# Altium project S11830_1.PrjPCB
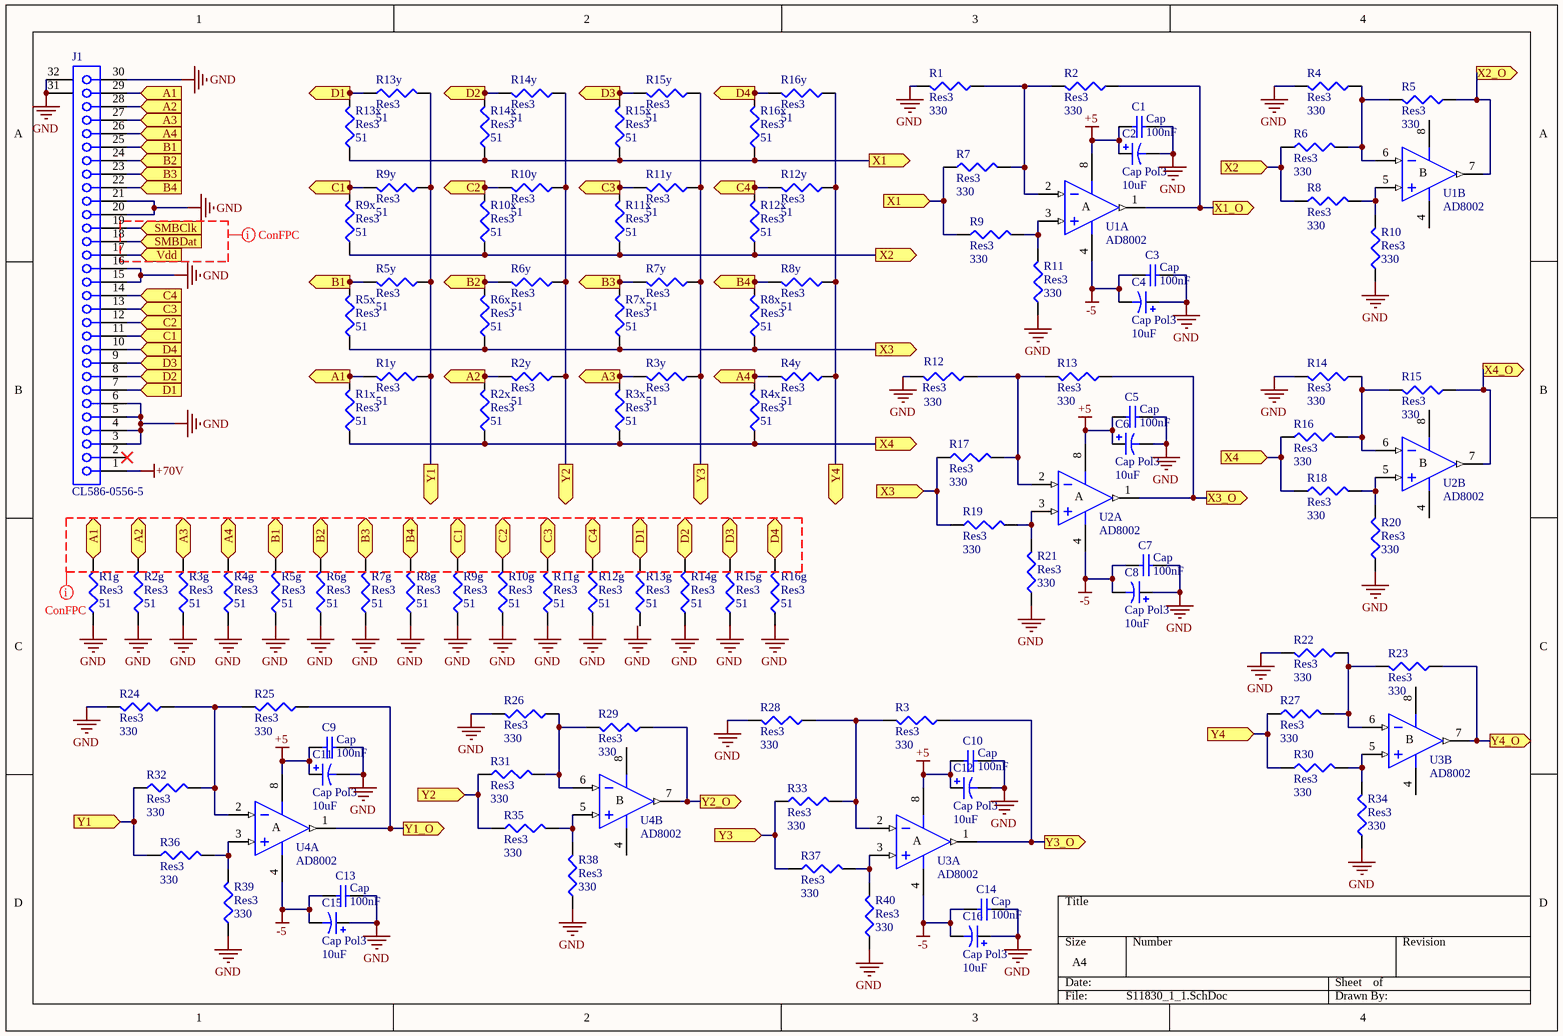
[diagram p0: S11830_1_1.SchDoc]
2 sheets, 204 parts. Net scope: flat (ports and power ports of the same name join across sheets).
Board file: S11830_1.PcbDoc
Sheets:
  S11830_1_1.SchDoc
  S11830_1_2.SchDoc

## Sheet S11830_1_1.SchDoc
size A4

### Parts
C1  Cap  value 100nF  [6-0805_N]
C2  Cap Pol3  value 10uF  [6-0805_N]
C3  Cap  value 100nF  [6-0805_N]
C4  Cap Pol3  value 10uF  [6-0805_N]
C5  Cap  value 100nF  [6-0805_N]
C6  Cap Pol3  value 10uF  [6-0805_N]
C7  Cap  value 100nF  [6-0805_N]
C8  Cap Pol3  value 10uF  [6-0805_N]
C9  Cap  value 100nF  [6-0805_N]
C10  Cap  value 100nF  [6-0805_N]
C11  Cap Pol3  value 10uF  [6-0805_N]
C12  Cap Pol3  value 10uF  [6-0805_N]
C13  Cap  value 100nF  [6-0805_N]
C14  Cap  value 100nF  [6-0805_N]
C15  Cap Pol3  value 10uF  [6-0805_N]
C16  Cap Pol3  value 10uF  [6-0805_N]
J1  CL586-0556-5  [FH12A-30S-0.5SH]
R1  Res3  value 330  [J1-0603]
R1g  Res3  value 51  [0402]
R1x  Res3  value 51  [0402]
R1y  Res3  value 51  [0402]
R2  Res3  value 330  [J1-0603]
R2g  Res3  value 51  [0402]
R2x  Res3  value 51  [0402]
R2y  Res3  value 51  [0402]
R3  Res3  value 330  [J1-0603]
R3g  Res3  value 51  [0402]
R3x  Res3  value 51  [0402]
R3y  Res3  value 51  [0402]
R4  Res3  value 330  [J1-0603]
R4g  Res3  value 51  [0402]
R4x  Res3  value 51  [0402]
R4y  Res3  value 51  [0402]
R5  Res3  value 330  [J1-0603]
R5g  Res3  value 51  [0402]
R5x  Res3  value 51  [0402]
R5y  Res3  value 51  [0402]
R6  Res3  value 330  [J1-0603]
R6g  Res3  value 51  [0402]
R6x  Res3  value 51  [0402]
R6y  Res3  value 51  [0402]
R7  Res3  value 330  [J1-0603]
R7g  Res3  value 51  [0402]
R7x  Res3  value 51  [0402]
R7y  Res3  value 51  [0402]
R8  Res3  value 330  [J1-0603]
R8g  Res3  value 51  [0402]
R8x  Res3  value 51  [0402]
R8y  Res3  value 51  [0402]
R9  Res3  value 330  [J1-0603]
R9g  Res3  value 51  [0402]
R9x  Res3  value 51  [0402]
R9y  Res3  value 51  [0402]
R10  Res3  value 330  [J1-0603]
R10g  Res3  value 51  [0402]
R10x  Res3  value 51  [0402]
R10y  Res3  value 51  [0402]
R11  Res3  value 330  [J1-0603]
R11g  Res3  value 51  [0402]
R11x  Res3  value 51  [0402]
R11y  Res3  value 51  [0402]
R12  Res3  value 330  [J1-0603]
R12g  Res3  value 51  [0402]
R12x  Res3  value 51  [0402]
R12y  Res3  value 51  [0402]
R13  Res3  value 330  [J1-0603]
R13g  Res3  value 51  [0402]
R13x  Res3  value 51  [0402]
R13y  Res3  value 51  [0402]
R14  Res3  value 330  [J1-0603]
R14g  Res3  value 51  [0402]
R14x  Res3  value 51  [0402]
R14y  Res3  value 51  [0402]
R15  Res3  value 330  [J1-0603]
R15g  Res3  value 51  [0402]
R15x  Res3  value 51  [0402]
R15y  Res3  value 51  [0402]
R16  Res3  value 330  [J1-0603]
R16g  Res3  value 51  [0402]
R16x  Res3  value 51  [0402]
R16y  Res3  value 51  [0402]
R17  Res3  value 330  [J1-0603]
R18  Res3  value 330  [J1-0603]
R19  Res3  value 330  [J1-0603]
R20  Res3  value 330  [J1-0603]
R21  Res3  value 330  [J1-0603]
R22  Res3  value 330  [J1-0603]
R23  Res3  value 330  [J1-0603]
R24  Res3  value 330  [J1-0603]
R25  Res3  value 330  [J1-0603]
R26  Res3  value 330  [J1-0603]
R27  Res3  value 330  [J1-0603]
R28  Res3  value 330  [J1-0603]
R29  Res3  value 330  [J1-0603]
R30  Res3  value 330  [J1-0603]
R31  Res3  value 330  [J1-0603]
R32  Res3  value 330  [J1-0603]
R33  Res3  value 330  [J1-0603]
R34  Res3  value 330  [J1-0603]
R35  Res3  value 330  [J1-0603]
R36  Res3  value 330  [J1-0603]
R37  Res3  value 330  [J1-0603]
R38  Res3  value 330  [J1-0603]
R39  Res3  value 330  [J1-0603]
R40  Res3  value 330  [J1-0603]
U1  AD8002  [SO-8_M]  (parts A,B of 2)
U2  AD8002  [SO-8_M]  (parts A,B of 2)
U3  AD8002  [SO-8_M]  (parts A,B of 2)
U4  AD8002  [SO-8_M]  (parts A,B of 2)

### Ports
A1 (in), A1 (out), A2 (in), A2 (out), A3 (in), A3 (out), A4 (in), A4 (out), B1 (in), B1 (out), B2 (in), B2 (out), B3 (in), B3 (out), B4 (in), B4 (out), C1 (in), C1 (out), C2 (in), C2 (out), C3 (in), C3 (out), C4 (in), C4 (out), D1 (in), D1 (out), D2 (in), D2 (out), D3 (in), D3 (out), D4 (in), D4 (out), SMBClk (in), SMBDat (in), Vdd (in), X1 (in), X1 (out), X1_O (out), X2 (in), X2 (out), X2_O (out), X3 (in), X3 (out), X3_O (out), X4 (in), X4 (out), X4_O (out), Y1 (in), Y1 (out), Y1_O (out), Y2 (in), Y2 (out), Y2_O (out), Y3 (in), Y3 (out), Y3_O (out), Y4 (in), Y4 (out), Y4_O (out)

### Nets
+5: C1.2 C2.1 C5.2 C6.1 C9.2 C10.2 C11.1 C12.1 U1.8(V+) U2.8(V+) U3.8(V+) U4.8(V+)
+70V: J1.1
-5: C3.2 C4.2 C7.2 C8.2 C13.2 C14.2 C15.2 C16.2 U1.4(V-) U2.4(V-) U3.4(V-) U4.4(V-)
GND: C1.1 C2.2 C3.1 C4.1 C5.1 C6.2 C7.1 C8.1 C9.1 C10.1 C11.2 C12.2 C13.1 C14.1 C15.1 C16.1 J1.3 J1.4 J1.5 J1.6 J1.15 J1.16 J1.20 J1.21 J1.30 J1.31(MH1) J1.32(MH2) R1.2 R1g.1 R2g.1 R3g.1 R4.2 R4g.1 R5g.1 R6g.1 R7g.1 R8g.1 R9g.1 R10.1 R10g.1 R11.1 R11g.1 R12.2 R12g.1 R14.2 R14g.1 R15g.1 R16g.1 R20.1 R21.1 R22.2 R24.2 R26.2 R28.2 R34.1 R38.1 R39.1 R40.1
NetC1x_1: R2.1 U1.1(OUT) ; port X1_O
NetC1y_1: R25.1 U4.1(OUT) ; port Y1_O
NetC2x_1: R5.1 U1.7(OUT) ; port X2_O
NetC2y_1: R29.1 U4.7(OUT) ; port Y2_O
NetC3x_1: R13.1 U2.1(OUT) ; port X3_O
NetC3y_1: R3.1 U3.1(OUT) ; port Y3_O
NetC4x_1: R15.1 U2.7(OUT) ; port X4_O
NetC4y_1: R23.1 U3.7(OUT) ; port Y4_O
NetJ1_7: J1.7 R13g.2 R13x.2 R13y.1 ; port D1
NetJ1_8: J1.8 R14g.2 R14x.2 R14y.2 ; port D2
NetJ1_9: J1.9 R15g.2 R15x.2 R15y.2 ; port D3
NetJ1_10: J1.10 R16g.2 R16x.2 R16y.2 ; port D4
NetJ1_11: J1.11 R9g.2 R9x.2 R9y.2 ; port C1
NetJ1_12: J1.12 R10g.2 R10x.2 R10y.2 ; port C2
NetJ1_13: J1.13 R11g.2 R11x.2 R11y.2 ; port C3
NetJ1_14: J1.14 R12g.2 R12x.2 R12y.2 ; port C4
NetJ1_17: J1.17 ; port Vdd
NetJ1_18: J1.18 ; port SMBDat
NetJ1_19: J1.19 ; port SMBClk
NetJ1_22: J1.22 R8g.2 R8x.2 R8y.2 ; port B4
NetJ1_23: J1.23 R7g.2 R7x.2 R7y.2 ; port B3
NetJ1_24: J1.24 R6g.2 R6x.2 R6y.2 ; port B2
NetJ1_25: J1.25 R5g.2 R5x.2 R5y.2 ; port B1
NetJ1_26: J1.26 R4g.2 R4x.2 R4y.2 ; port A4
NetJ1_27: J1.27 R3g.2 R3x.2 R3y.2 ; port A3
NetJ1_28: J1.28 R2g.2 R2x.2 R2y.2 ; port A2
NetJ1_29: J1.29 R1g.2 R1x.2 R1y.2 ; port A1
NetR1_1: R1.1 R2.2 R7.2 U1.2(IN-)
NetR1x_1: R1x.1 R2x.1 R3x.1 R4x.1 R16.1 R18.1 ; port X4
NetR1y_1: R1y.1 R5y.1 R9y.1 R13y.2 R32.1 R36.1 ; port Y1
NetR2y_1: R2y.1 R6y.1 R10y.1 R14y.1 R31.1 R35.1 ; port Y2
NetR3_2: R3.2 R28.1 R33.2 U3.2(IN-)
NetR3y_1: R3y.1 R7y.1 R11y.1 R15y.1 R33.1 R37.1 ; port Y3
NetR4_1: R4.1 R5.2 R6.2 U1.6(IN-)
NetR4y_1: R4y.1 R8y.1 R12y.1 R16y.1 R27.1 R30.1 ; port Y4
NetR5x_1: R5x.1 R6x.1 R7x.1 R8x.1 R17.1 R19.1 ; port X3
NetR6_1: R6.1 R8.1 R9x.1 R10x.1 R11x.1 R12x.1 ; port X2
NetR7_1: R7.1 R9.1 R13x.1 R14x.1 R15x.1 R16x.1 ; port X1
NetR8_2: R8.2 R10.2 U1.5(IN+)
NetR9_2: R9.2 R11.2 U1.3(IN+)
NetR12_1: R12.1 R13.2 R17.2 U2.2(IN-)
NetR14_1: R14.1 R15.2 R16.2 U2.6(IN-)
NetR18_2: R18.2 R20.2 U2.5(IN+)
NetR19_2: R19.2 R21.2 U2.3(IN+)
NetR22_1: R22.1 R23.2 R27.2 U3.6(IN-)
NetR24_1: R24.1 R25.2 R32.2 U4.2(IN-)
NetR26_1: R26.1 R29.2 R31.2 U4.6(IN-)
NetR30_2: R30.2 R34.2 U3.5(IN+)
NetR35_2: R35.2 R38.2 U4.5(IN+)
NetR36_2: R36.2 R39.2 U4.3(IN+)
NetR37_2: R37.2 R40.2 U3.3(IN+)

Not connected (* = marked no-connect by the designer): J1 2*; R13g 1

### Layout directives
net class Undefined: (no net found under the mark)

### Notes on the sheet
- Labels drawn without touching a wire or pin: GND
- (in symbol AD8002AR, part A) A
- (in symbol AD8002AR, part B) B

### Library data of the parts
C1 C3 C5 C7 C9 C10 C13 C14 = Cap: Capacitor; Published: 8-Jun-2000; LatestRevisionDate: 17-Jul-2002; LatestRevisionNote: Re-released for DXP Platform.; PackageReference: RAD-0.3; Publisher: Altium Limited; PackageDescription: Radial Cap, Thru-Hole; 2 Leads; 0.3 in Pin Spacing
C2 C4 C6 C8 C11 C12 C15 C16 = Cap Pol3: Polarized Capacitor (Surface Mount); Published: 8-Jun-2000; LatestRevisionDate: 29-May-2009; LatestRevisionNote: IPC-7351 Footprint Added.; PackageReference: C0805; Publisher: Altium Limited; PackageDescription: Chip Capacitor
J1 = CL586-0556-5: FH12 Series, "Flip-Lock" SMT/ZIF FFC/FPC Connector - 0.5mm Spaced Top Contact; Positions: 30; ContactMaterial: Phosphor Bronze; Current: 0.4A; PCB_Layout: Complies with manufacturer's recommendation.; Note: Pad dimensions follow nominal values, Suitable for Wave Soldering, Adjust for Re-flow.; Published: 17-Jul-2002; DatasheetVersion: 13-Nov-2000; PackageVersion: 13-Nov-2000; PackageReference: FH12A-30S-0.5SH; Publisher: Altium Limited; ComponentLink1Description: Manufacturer Link; ComponentLink1URL: http://www.hiroseusa.com/; ComponentLink2Description: Datasheet; ComponentLink2URL: http://www.hirose.co.jp/cataloge_hp/e58605370.pdf
R1 R1g R1x R1y R2 R2g R2x R2y R3 R3g R3x R3y R4 R4g R4x R4y R5 R5g R5x R5y R6 R6g R6x R6y R7 R7g R7x R7y R8 R8g R8x R8y R9 R9g R9x R9y R10 R10g R10x R10y R11 R11g R11x R11y R12 R12g R12x R12y R13 R13g R13x R13y R14 R14g R14x R14y R15 R15g R15x R15y R16 R16g R16x R16y R17-R40 = Res3: Resistor; Published: 8-Jun-2000; LatestRevisionDate: 29-May-2009; LatestRevisionNote: IPC-7351 Footprint Added.; PackageReference: J1-0603; Publisher: Altium Limited; PackageDescription: Chip Resistor
U1-U4 = AD8002AR: Dual 600MHz, 50mW Current Feedback Amplifier; Published: 8-Jun-2000; LatestRevisionDate: 13-Apr-2006; LatestRevisionNote: IPC-7351 Footprint Added.; DatasheetVersion: REV. C 1999; PackageVersion: revA; PackageReference: SO-8; Publisher: Altium Limited; PackageDescription: 8-Pin Small Outline Integrated Circuit 1.27 mm Pitch; Code_JEDEC: MS-012-AA; Code_IPC: SOIC127P600-8; ComponentLink1Description: Manufacturer Link; ComponentLink1URL: http://www.analog.com/en/prod/0,,759_786_AD8002%2C00.html; ComponentLink2Description: Datasheet; ComponentLink2URL: http://www.analog.com/UploadedFiles/Data_Sheets/147523773AD8002_d.pdf

## Sheet S11830_1_2.SchDoc
size A4
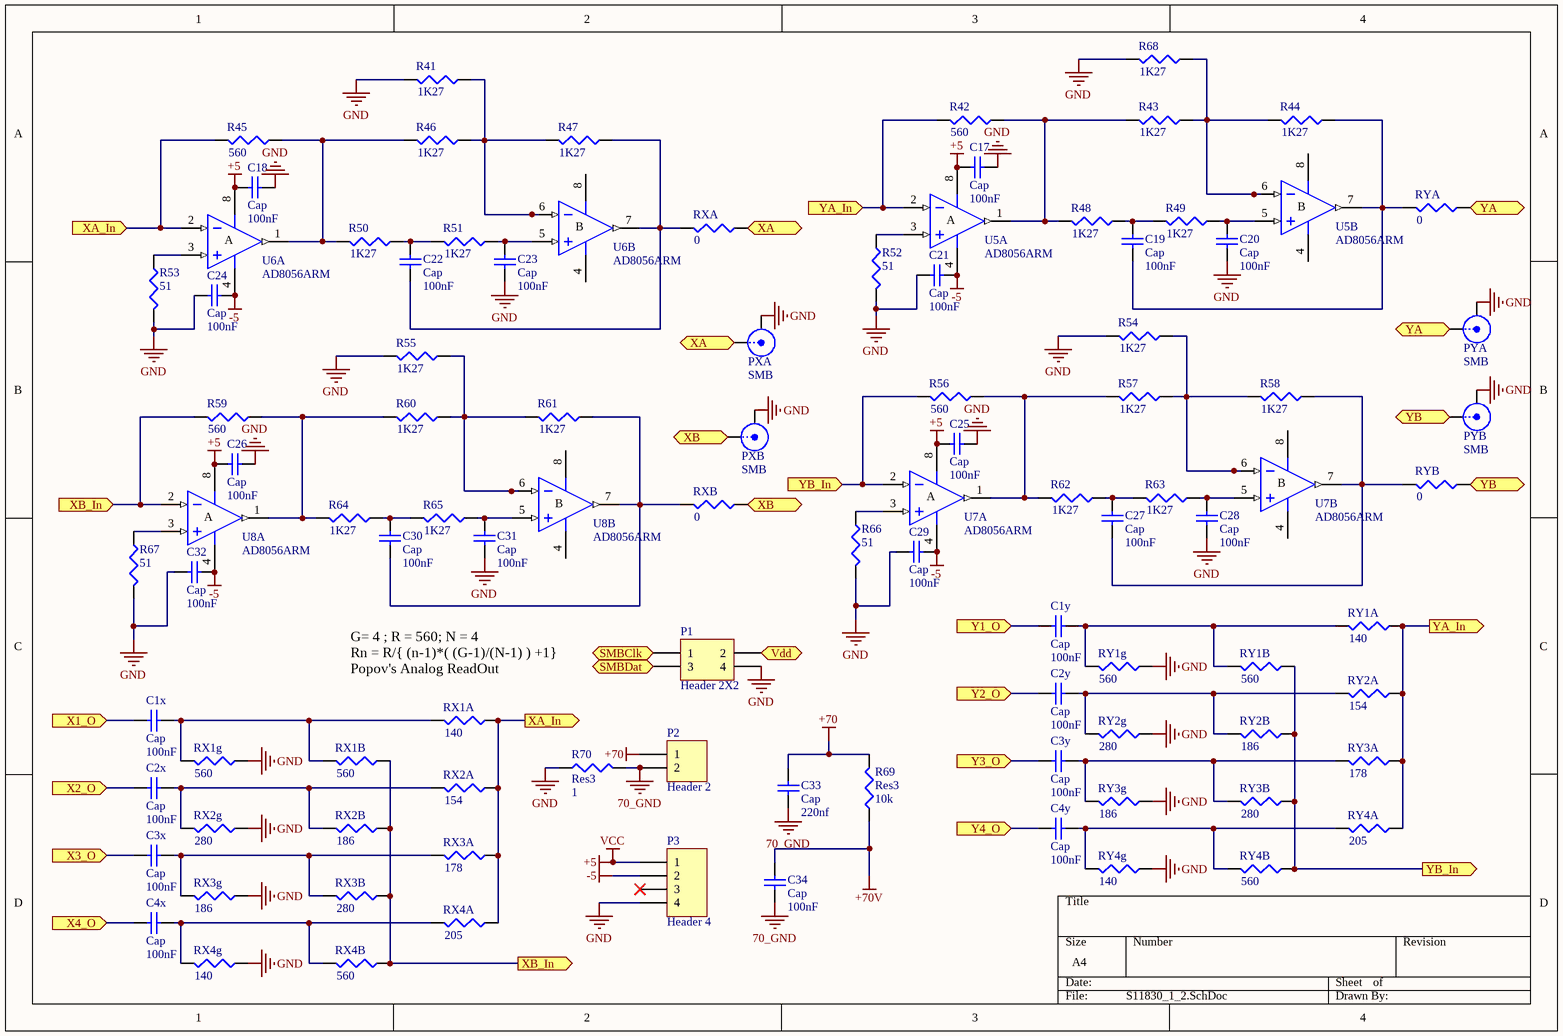
[diagram p1: S11830_1_2.SchDoc]

### Parts
C1x  Cap  value 100nF  [1608[0603]]
C1y  Cap  value 100nF  [1608[0603]]
C2x  Cap  value 100nF  [1608[0603]]
C2y  Cap  value 100nF  [1608[0603]]
C3x  Cap  value 100nF  [1608[0603]]
C3y  Cap  value 100nF  [1608[0603]]
C4x  Cap  value 100nF  [1608[0603]]
C4y  Cap  value 100nF  [1608[0603]]
C17  Cap  value 100nF  [1608[0603]]
C18  Cap  value 100nF  [1608[0603]]
C19  Cap  value 100nF  [1608[0603]]
C20  Cap  value 100nF  [1608[0603]]
C21  Cap  value 100nF  [1608[0603]]
C22  Cap  value 100nF  [1608[0603]]
C23  Cap  value 100nF  [1608[0603]]
C24  Cap  value 100nF  [1608[0603]]
C25  Cap  value 100nF  [1608[0603]]
C26  Cap  value 100nF  [1608[0603]]
C27  Cap  value 100nF  [1608[0603]]
C28  Cap  value 100nF  [1608[0603]]
C29  Cap  value 100nF  [1608[0603]]
C30  Cap  value 100nF  [1608[0603]]
C31  Cap  value 100nF  [1608[0603]]
C32  Cap  value 100nF  [1608[0603]]
C33  Cap  value 220nf  [6-0805_N]
C34  Cap  value 100nF  [6-0805_N]
P1  Header 2X2  [HDR2X2]
P2  Header 2  [HDR1X2]
P3  Header 4  [HDR1X4]
PXA  SMB  [SMB_V-RJ45]
PXB  SMB  [SMB_V-RJ45]
PYA  SMB  [SMB_V-RJ45]
PYB  SMB  [SMB_V-RJ45]
R41  value 1K27  [J1-0603]  (hidden comment: Res3)
R42  value 560  [J1-0603]  (hidden comment: Res3)
R43  value 1K27  [J1-0603]  (hidden comment: Res3)
R44  value 1K27  [J1-0603]  (hidden comment: Res3)
R45  value 560  [J1-0603]  (hidden comment: Res3)
R46  value 1K27  [J1-0603]  (hidden comment: Res3)
R47  value 1K27  [J1-0603]  (hidden comment: Res3)
R48  value 1K27  [J1-0603]  (hidden comment: Res3)
R49  value 1K27  [J1-0603]  (hidden comment: Res3)
R50  value 1K27  [J1-0603]  (hidden comment: Res3)
R51  value 1K27  [J1-0603]  (hidden comment: Res3)
R52  value 51  [J1-0603]  (hidden comment: Res3)
R53  value 51  [J1-0603]  (hidden comment: Res3)
R54  value 1K27  [J1-0603]  (hidden comment: Res3)
R55  value 1K27  [J1-0603]  (hidden comment: Res3)
R56  value 560  [J1-0603]  (hidden comment: Res3)
R57  value 1K27  [J1-0603]  (hidden comment: Res3)
R58  value 1K27  [J1-0603]  (hidden comment: Res3)
R59  value 560  [J1-0603]  (hidden comment: Res3)
R60  value 1K27  [J1-0603]  (hidden comment: Res3)
R61  value 1K27  [J1-0603]  (hidden comment: Res3)
R62  value 1K27  [J1-0603]  (hidden comment: Res3)
R63  value 1K27  [J1-0603]  (hidden comment: Res3)
R64  value 1K27  [J1-0603]  (hidden comment: Res3)
R65  value 1K27  [J1-0603]  (hidden comment: Res3)
R66  value 51  [J1-0603]  (hidden comment: Res3)
R67  value 51  [J1-0603]  (hidden comment: Res3)
R68  value 1K27  [J1-0603]  (hidden comment: Res3)
R69  Res3  value 10k  [6-0805_N]
R70  Res3  value 1  [6-0805_N]
RX1A  value 140  [J1-0603]  (hidden comment: Res3)
RX1B  value 560  [J1-0603]  (hidden comment: Res3)
RX1g  value 560  [J1-0603]  (hidden comment: Res3)
RX2A  value 154  [J1-0603]  (hidden comment: Res3)
RX2B  value 186  [J1-0603]  (hidden comment: Res3)
RX2g  value 280  [J1-0603]  (hidden comment: Res3)
RX3A  value 178  [J1-0603]  (hidden comment: Res3)
RX3B  value 280  [J1-0603]  (hidden comment: Res3)
RX3g  value 186  [J1-0603]  (hidden comment: Res3)
RX4A  value 205  [J1-0603]  (hidden comment: Res3)
RX4B  value 560  [J1-0603]  (hidden comment: Res3)
RX4g  value 140  [J1-0603]  (hidden comment: Res3)
RXA  value 0  [J1-0603]  (hidden comment: Res3)
RXB  value 0  [J1-0603]  (hidden comment: Res3)
RY1A  value 140  [J1-0603]  (hidden comment: Res3)
RY1B  value 560  [J1-0603]  (hidden comment: Res3)
RY1g  value 560  [J1-0603]  (hidden comment: Res3)
RY2A  value 154  [J1-0603]  (hidden comment: Res3)
RY2B  value 186  [J1-0603]  (hidden comment: Res3)
RY2g  value 280  [J1-0603]  (hidden comment: Res3)
RY3A  value 178  [J1-0603]  (hidden comment: Res3)
RY3B  value 280  [J1-0603]  (hidden comment: Res3)
RY3g  value 186  [J1-0603]  (hidden comment: Res3)
RY4A  value 205  [J1-0603]  (hidden comment: Res3)
RY4B  value 560  [J1-0603]  (hidden comment: Res3)
RY4g  value 140  [J1-0603]  (hidden comment: Res3)
RYA  value 0  [J1-0603]  (hidden comment: Res3)
RYB  value 0  [J1-0603]  (hidden comment: Res3)
U5  AD8056ARM  [SO8_M]  (parts A,B of 2)
U6  AD8056ARM  [SO8_M]  (parts A,B of 2)
U7  AD8056ARM  [SO8_M]  (parts A,B of 2)
U8  AD8056ARM  [SO8_M]  (parts A,B of 2)

### Ports
SMBClk (in), SMBDat (in), Vdd (in), X1_O (in), X2_O (in), X3_O (in), X4_O (in), XA (out), XA_In (in), XA_In (out), XB (out), XB_In (in), XB_In (out), Y1_O (in), Y2_O (in), Y3_O (in), Y4_O (in), YA (out), YA_In (in), YA_In (out), YB (out), YB_In (in), YB_In (out)

### Nets
70_GND: C33.1 C34.1 P2.2 R70.2
+5: C17.1 C18.1 C25.1 C26.1 P3.1 U5.8(V+) U6.8(V+) U7.8(V+) U8.8(V+)  [also labelled VCC]
+70: C33.2 P2.1 R69.2
+70V: C34.2 R69.1
-5: C21.2 C24.2 C29.2 C32.2 P3.2 U5.4(V-) U6.4(V-) U7.4(V-) U8.4(V-)
GND: C17.2 C18.2 C20.2 C21.1 C23.2 C24.1 C25.2 C26.2 C28.2 C29.1 C31.2 C32.1 P1.4 P3.4 PXA.2(Y) PXB.2(Y) PYA.2(Y) PYB.2(Y) R41.2 R52.2 R53.2 R54.2 R55.2 R66.2 R67.2 R68.2 R70.1 RX1g.1 RX2g.1 RX3g.1 RX4g.1 RY1g.1 RY2g.1 RY3g.1 RY4g.1
NetC1x_1: C1x.1 ; port X1_O
NetC1x_2: C1x.2 RX1A.2 RX1B.2 RX1g.2
NetC1y_1: C1y.1 ; port Y1_O
NetC1y_2: C1y.2 RY1A.2 RY1B.2 RY1g.2
NetC2x_1: C2x.1 ; port X2_O
NetC2x_2: C2x.2 RX2A.2 RX2B.2 RX2g.2
NetC2y_1: C2y.1 ; port Y2_O
NetC2y_2: C2y.2 RY2A.2 RY2B.2 RY2g.2
NetC3x_1: C3x.1 ; port X3_O
NetC3x_2: C3x.2 RX3A.2 RX3B.2 RX3g.2
NetC3y_1: C3y.1 ; port Y3_O
NetC3y_2: C3y.2 RY3A.2 RY3B.2 RY3g.2
NetC4x_1: C4x.1 ; port X4_O
NetC4x_2: C4x.2 RX4A.2 RX4B.2 RX4g.2
NetC4y_1: C4y.1 ; port Y4_O
NetC4y_2: C4y.2 RY4A.2 RY4B.2 RY4g.2
NetC19_1: C19.1 R48.1 R49.2
NetC19_2: C19.2 R44.1 RYA.2 U5.7(OUT)
NetC20_1: C20.1 R49.1 U5.5(IN+)
NetC22_1: C22.1 R50.1 R51.2
NetC22_2: C22.2 R47.1 RXA.2 U6.7(OUT)
NetC23_1: C23.1 R51.1 U6.5(IN+)
NetC27_1: C27.1 R62.1 R63.2
NetC27_2: C27.2 R58.1 RYB.2 U7.7(OUT)
NetC28_1: C28.1 R63.1 U7.5(IN+)
NetC30_1: C30.1 R64.1 R65.2
NetC30_2: C30.2 R61.1 RXB.2 U8.7(OUT)
NetC31_1: C31.1 R65.1 U8.5(IN+)
NetJ1_17: P1.2 ; port Vdd
NetJ1_18: P1.3 ; port SMBDat
NetJ1_19: P1.1 ; port SMBClk
NetPXA_1: PXA.1(X) RXA.1 ; port XA
NetPXB_1: PXB.1(X) RXB.1 ; port XB
NetPYA_1: PYA.1(X) RYA.1 ; port YA
NetPYB_1: PYB.1(X) RYB.1 ; port YB
NetR41_1: R41.1 R46.1 R47.2 U6.6(IN-)
NetR42_1: R42.1 R43.2 R48.2 U5.1(OUT)
NetR42_2: R42.2 RY1A.1 RY2A.1 RY3A.1 RY4A.1 U5.2(IN-) ; port YA_In
NetR43_1: R43.1 R44.2 R68.1 U5.6(IN-)
NetR45_1: R45.1 R46.2 R50.2 U6.1(OUT)
NetR45_2: R45.2 RX1A.1 RX2A.1 RX3A.1 RX4A.1 U6.2(IN-) ; port XA_In
NetR52_1: R52.1 U5.3(IN+)
NetR53_1: R53.1 U6.3(IN+)
NetR54_1: R54.1 R57.1 R58.2 U7.6(IN-)
NetR55_1: R55.1 R60.1 R61.2 U8.6(IN-)
NetR56_1: R56.1 R57.2 R62.2 U7.1(OUT)
NetR56_2: R56.2 RY1B.1 RY2B.1 RY3B.1 RY4B.1 U7.2(IN-) ; port YB_In
NetR59_1: R59.1 R60.2 R64.2 U8.1(OUT)
NetR59_2: R59.2 RX1B.1 RX2B.1 RX3B.1 RX4B.1 U8.2(IN-) ; port XB_In
NetR66_1: R66.1 U7.3(IN+)
NetR67_1: R67.1 U8.3(IN+)

Not connected (* = marked no-connect by the designer): P3 3*

### Notes on the sheet
- (near RX1A) G= 4 ; R = 560; N = 4
  Rn = R/{ (n-1)*( (G-1)/(N-1) ) +1}
  Popov's Analog ReadOut
- (in symbol AD8056ARM, part A) A
- (in symbol AD8056ARM, part B) B

### Library data of the parts
C1x C1y C2x C2y C3x C3y C4x C4y C17-C34 = Cap: Capacitor; Published: 8-Jun-2000; LatestRevisionDate: 17-Jul-2002; LatestRevisionNote: Re-released for DXP Platform.; PackageReference: RAD-0.3; Publisher: Altium Limited; PackageDescription: Radial Cap, Thru-Hole; 2 Leads; 0.3 in Pin Spacing
P1 = Header 2X2: Header, 2-Pin, Dual row; LatestRevisionDate: 17-Jul-2002; LatestRevisionNote: Re-released for DXP Platform.; Publisher: Altium Limited
P2 = Header 2: Header, 2-Pin; LatestRevisionDate: 17-Jul-2002; LatestRevisionNote: Re-released for DXP Platform.; Publisher: Altium Limited
P3 = Header 4: Header, 4-Pin; LatestRevisionDate: 17-Jul-2002; LatestRevisionNote: Re-released for DXP Platform.; Publisher: Altium Limited
PXA PXB PYA PYB = SMB: SMB Straight Connector; LatestRevisionDate: 17-Jul-2002; LatestRevisionNote: Re-released for DXP Platform.; Publisher: Altium Limited
R41-R70 RX1A RX1B RX1g RX2A RX2B RX2g RX3A RX3B RX3g RX4A RX4B RX4g RXA RXB RY1A RY1B RY1g RY2A RY2B RY2g RY3A RY3B RY3g RY4A RY4B RY4g RYA RYB = Res3: Resistor; Published: 8-Jun-2000; LatestRevisionDate: 29-May-2009; LatestRevisionNote: IPC-7351 Footprint Added.; PackageReference: J1-0603; Publisher: Altium Limited; PackageDescription: Chip Resistor
U5-U8 = AD8056ARM: Low Cost, 300MHz Voltage Feedback Amplifier; Published: 8-Jun-2000; LatestRevisionDate: 04-Mar-2005; LatestRevisionNote: Stylized 3D Model Added, PCB footprint pad width decreased.; DatasheetVersion: REV. 0 1997; PackageVersion: 2004; PackageReference: RM-8; Publisher: Altium Limited; PackageDescription: Shrink Small Outline, MSOP; 8 Leads; Body Width 3 mm; Pitch 0.65 mm; Code_JEDEC: MO-187-AA; ComponentLink1Description: Manufacturer Link; ComponentLink1URL: http://www.analog.com/en/prod/0,,759_786_AD8055%2C00.html; ComponentLink2Description: Datasheet; ComponentLink2URL: http://www.analog.com/UploadedFiles/Data_Sheets/40402558757264AD8055_6_i.pdf

## Nets that join several sheets
+5: S11830_1_1 (12 pins), S11830_1_2 (9 pins)
+70V: S11830_1_1 (J1.1), S11830_1_2 (C34.2 R69.1)
-5: S11830_1_1 (12 pins), S11830_1_2 (9 pins)
GND: S11830_1_1 (58 pins), S11830_1_2 (35 pins)
NetC1x_1: S11830_1_1 (R2.1 U1.1), S11830_1_2 (C1x.1)
NetC1y_1: S11830_1_1 (R25.1 U4.1), S11830_1_2 (C1y.1)
NetC2x_1: S11830_1_1 (R5.1 U1.7), S11830_1_2 (C2x.1)
NetC2y_1: S11830_1_1 (R29.1 U4.7), S11830_1_2 (C2y.1)
NetC3x_1: S11830_1_1 (R13.1 U2.1), S11830_1_2 (C3x.1)
NetC3y_1: S11830_1_1 (R3.1 U3.1), S11830_1_2 (C3y.1)
NetC4x_1: S11830_1_1 (R15.1 U2.7), S11830_1_2 (C4x.1)
NetC4y_1: S11830_1_1 (R23.1 U3.7), S11830_1_2 (C4y.1)
NetJ1_17: S11830_1_1 (J1.17), S11830_1_2 (P1.2)
NetJ1_18: S11830_1_1 (J1.18), S11830_1_2 (P1.3)
NetJ1_19: S11830_1_1 (J1.19), S11830_1_2 (P1.1)